# Altium schematic sheet DDR3-RAM.SchDoc: TE0723 - DDR Memory
size A4; Organization: Trenz Electronic GmbH; DocumentNumber: TE0723; Revision: 01; SheetNumber: 8; SheetTotal: 12; Date: 08.07.2015; Author: Indrek Tubalkain; CompanyName: Trenz Electronic GmbH; DrawnBy: Indrek Tubalkain; Engineer: Indrek Tubalkain; ProjectName: TE0723 Arduino
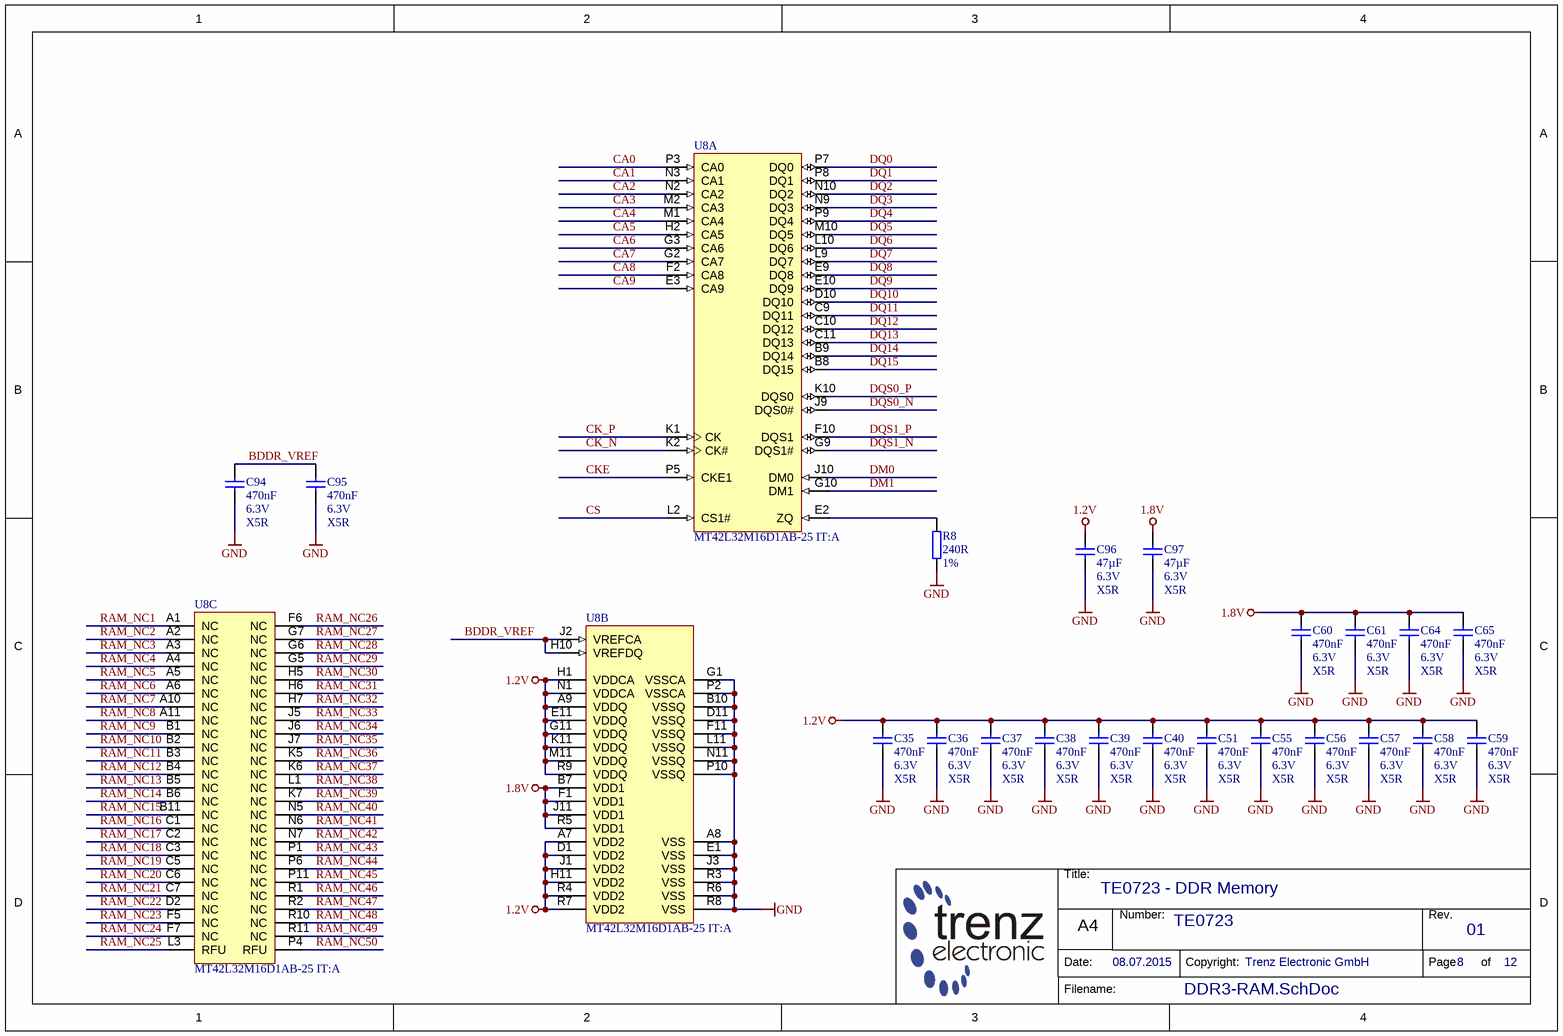
[diagram p0: DDR3-RAM.SchDoc]

## Parts
C35  470nF  Voltage: 6.3V  Technology: X5R  [CAPC0603X33N]
C36  470nF  Voltage: 6.3V  Technology: X5R  [CAPC0603X33N]
C37  470nF  Voltage: 6.3V  Technology: X5R  [CAPC0603X33N]
C38  470nF  Voltage: 6.3V  Technology: X5R  [CAPC0603X33N]
C39  470nF  Voltage: 6.3V  Technology: X5R  [CAPC0603X33N]
C40  470nF  Voltage: 6.3V  Technology: X5R  [CAPC0603X33N]
C51  470nF  Voltage: 6.3V  Technology: X5R  [CAPC0603X33N]
C55  470nF  Voltage: 6.3V  Technology: X5R  [CAPC0603X33N]
C56  470nF  Voltage: 6.3V  Technology: X5R  [CAPC0603X33N]
C57  470nF  Voltage: 6.3V  Technology: X5R  [CAPC0603X33N]
C58  470nF  Voltage: 6.3V  Technology: X5R  [CAPC0603X33N]
C59  470nF  Voltage: 6.3V  Technology: X5R  [CAPC0603X33N]
C60  470nF  Voltage: 6.3V  Technology: X5R  [CAPC0603X33N]
C61  470nF  Voltage: 6.3V  Technology: X5R  [CAPC0603X33N]
C64  470nF  Voltage: 6.3V  Technology: X5R  [CAPC0603X33N]
C65  470nF  Voltage: 6.3V  Technology: X5R  [CAPC0603X33N]
C94  470nF  Voltage: 6.3V  Technology: X5R  [CAPC0603X33N]
C95  470nF  Voltage: 6.3V  Technology: X5R  [CAPC0603X33N]
C96  47µF  Voltage: 6.3V  Technology: X5R  [CAPC2012X135N]
C97  47µF  Voltage: 6.3V  Technology: X5R  [CAPC2012X135N]
R8  240R  Tolerance: 1%  [RESC1005X40N]
U8  MT42L32M16D1AB-25 IT:A  [BGA121C50P15X11_800X650X80B32N]  (parts A,B,C of 3)

## Nets
1.2V: C35.1 C36.1 C37.1 C38.1 C39.1 C40.1 C51.1 C55.1 C56.1 C57.1 C58.1 C59.1 C96.1 U8.A7(VDD2) U8.A9(VDDQ) U8.D1(VDD2) U8.E11(VDDQ) U8.G11(VDDQ) U8.H1(VDDCA) U8.H11(VDD2) U8.J1(VDD2) U8.K11(VDDQ) U8.M11(VDDQ) U8.N1(VDDCA) U8.R4(VDD2) U8.R7(VDD2) U8.R9(VDDQ)
1.8V: C60.1 C61.1 C64.1 C65.1 C97.1 U8.B7(VDD1) U8.F1(VDD1) U8.J11(VDD1) U8.R5(VDD1)
GND: C35.2 C36.2 C37.2 C38.2 C39.2 C40.2 C51.2 C55.2 C56.2 C57.2 C58.2 C59.2 C60.2 C61.2 C64.2 C65.2 C94.2 C95.2 C96.2 C97.2 R8.2 U8.A8(VSS) U8.B10(VSSQ) U8.D11(VSSQ) U8.E1(VSS) U8.F11(VSSQ) U8.G1(VSSCA) U8.J3(VSS) U8.L11(VSSQ) U8.N11(VSSQ) U8.P2(VSSCA) U8.P10(VSSQ) U8.R3(VSS) U8.R6(VSS) U8.R8(VSS)
BDDR_VREF: C94.1 C95.1 U8.H10(VREFDQ) U8.J2(VREFCA)
CA0: U8.P3(CA0)
CA1: U8.N3(CA1)
CA2: U8.N2(CA2)
CA3: U8.M2(CA3)
CA4: U8.M1(CA4)
CA5: U8.H2(CA5)
CA6: U8.G3(CA6)
CA7: U8.G2(CA7)
CA8: U8.F2(CA8)
CA9: U8.E3(CA9)
CK_N: U8.K2(CK#)
CK_P: U8.K1(CK)
CKE: U8.P5(CKE1)
CS: U8.L2(CS1#)
DM0: U8.J10(DM0)
DM1: U8.G10(DM1)
DQ0: U8.P7(DQ0)
DQ1: U8.P8(DQ1)
DQ2: U8.N10(DQ2)
DQ3: U8.N9(DQ3)
DQ4: U8.P9(DQ4)
DQ5: U8.M10(DQ5)
DQ6: U8.L10(DQ6)
DQ7: U8.L9(DQ7)
DQ8: U8.E9(DQ8)
DQ9: U8.E10(DQ9)
DQ10: U8.D10(DQ10)
DQ11: U8.C9(DQ11)
DQ12: U8.C10(DQ12)
DQ13: U8.C11(DQ13)
DQ14: U8.B9(DQ14)
DQ15: U8.B8(DQ15)
DQS0_N: U8.J9(DQS0#)
DQS0_P: U8.K10(DQS0)
DQS1_N: U8.G9(DQS1#)
DQS1_P: U8.F10(DQS1)
RAM_NC1: U8.A1(NC)
RAM_NC2: U8.A2(NC)
RAM_NC3: U8.A3(NC)
RAM_NC4: U8.A4(NC)
RAM_NC5: U8.A5(NC)
RAM_NC6: U8.A6(NC)
RAM_NC7: U8.A10(NC)
RAM_NC8: U8.A11(NC)
RAM_NC9: U8.B1(NC)
RAM_NC10: U8.B2(NC)
RAM_NC11: U8.B3(NC)
RAM_NC12: U8.B4(NC)
RAM_NC13: U8.B5(NC)
RAM_NC14: U8.B6(NC)
RAM_NC15: U8.B11(NC)
RAM_NC16: U8.C1(NC)
RAM_NC17: U8.C2(NC)
RAM_NC18: U8.C3(NC)
RAM_NC19: U8.C5(NC)
RAM_NC20: U8.C6(NC)
RAM_NC21: U8.C7(NC)
RAM_NC22: U8.D2(NC)
RAM_NC23: U8.F5(NC)
RAM_NC24: U8.F7(NC)
RAM_NC25: U8.L3(RFU)
RAM_NC26: U8.F6(NC)
RAM_NC27: U8.G7(NC)
RAM_NC28: U8.G6(NC)
RAM_NC29: U8.G5(NC)
RAM_NC30: U8.H5(NC)
RAM_NC31: U8.H6(NC)
RAM_NC32: U8.H7(NC)
RAM_NC33: U8.J5(NC)
RAM_NC34: U8.J6(NC)
RAM_NC35: U8.J7(NC)
RAM_NC36: U8.K5(NC)
RAM_NC37: U8.K6(NC)
RAM_NC38: U8.L1(NC)
RAM_NC39: U8.K7(NC)
RAM_NC40: U8.N5(NC)
RAM_NC41: U8.N6(NC)
RAM_NC42: U8.N7(NC)
RAM_NC43: U8.P1(NC)
RAM_NC44: U8.P6(NC)
RAM_NC45: U8.P11(NC)
RAM_NC46: U8.R1(NC)
RAM_NC47: U8.R2(NC)
RAM_NC48: U8.R10(NC)
RAM_NC49: U8.R11(NC)
RAM_NC50: U8.P4(RFU)
NetR8_1: R8.1 U8.E2(ZQ)

## Notes on the sheet
- Title:
- Number:
- Rev.
- Date:
- A4
- Copyright:
- Page
- of
- Filename:

## Library data of the parts
C35-C40 C51 C55-C61 C64 C65 C94 C95 = 24921: KON 470nF X5R 6.3V SMD 20%; AN: 24921; Mixed: SMT; Value: 470n; Preferred: Yes; Case: 0603 (0201); Tolerance: 20%
C96 C97 = 24718: KON 47µF 6,3V  X5R SMD 20%; AN: 24718; Mixed: SMT; Value: 47u; Preferred: Yes; Case: 2012 (0805); Tolerance: 20%
R8 = 23661: WID SMD 240R 1% 0,063W; AN: 23661; Mixed: SMT; Value: 240; Preferred: Yes; Case: 1005 (0402)
U8 = 26300: AN: 26300; Mixed: SMT; Case: BGA121; HelpURL: B:\AD\adlib\datasheet\MT42LxxMxxD1